# Altium schematic sheet sch.SchDoc
size A; SheetNumber: 1; SheetTotal: 1
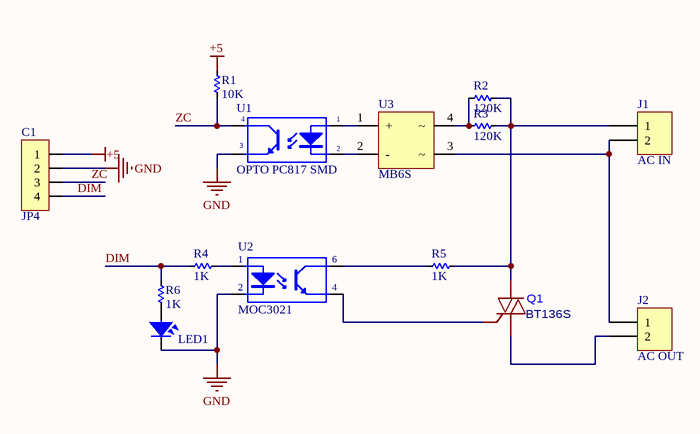
[diagram p0: sch.SchDoc]

## Parts
C1  JP4  [JP4-D1C]
J1  AC IN  [CON 2 2EDG5.08]
J2  AC OUT  [CON 2 2EDG5.08]
LED1  LED  [LED-0805-Red]  (value not drawn)
Q1  BT136S  [TO-252-3_L6.6-W6.1-P4.57-LS9.9-BR-CW]
R1  10K  [RES-SMD-0805]
R2  120K  [RES-SMD-1210]
R3  120K  [RES-SMD-1210]
R4  1K  [RES-SMD-0805]
R5  1K  [RES-SMD-0805]
R6  1K  [RES-SMD-0805]
U1  OPTO PC817 SMD  [SOP4]
U2  MOC3021  [SO6]
U3  MB6S  [TO269AA]

## Nets
+5: C1.1 R1.1
GND: C1.2 LED1.2 U1.3(E) U2.2(K)
DIM: C1.4 R4.2 R6.1
ZC: C1.3 R1.2 U1.4(C)
NetJ1_1: J1.1 Q1.2(T2) R2.1 R3.1 R5.1
NetJ1_2: J1.2 J2.1 U3.3
NetJ2_2: J2.2 Q1.1(T1)
NetLED1_1: LED1.1 R6.2
NetQ1_3: Q1.3(G) U2.4(E)
NetR2_2: R2.2 R3.2 U3.4
NetR4_1: R4.1 U2.1(A)
NetR5_2: R5.2 U2.6(C)
NetU1_1: U1.1(A) U3.1(+)
NetU1_2: U1.2(K) U3.2(-)

## Library data of the parts
C1 = JP4: WR-PHD 2.54 mm Angled Socket Header; Manufacturer: W¨¹rth Elektronik eiSos GmbH; partNo: 613004143121; ComponentLink1 Description: Manufacturer; ComponentLink2 Description: Datasheet; NoPins: 04; Created Date: 29 March 2013; ComponentLink1URL: http://www.we-online.com; ComponentLink2URL: http://katalog.we-online.de/em/datasheet/6130xx143121.pdf; Created by: Karrer Zheng
J1 J2 = CON 2: CON2 KF terminal
LED1 = LED SMD: Value: LED 3 - 5 ly 2 Colour
Q1 = BT136-800E_C2901010
R1-R6 = Res-SMD: Resistor; Manufacturer: Generic Components; Class: Passive; Published: 08/06/2000; Publisher: Altium Hobart Technology Centre
U1 = OPTO PC817 SMD: Single Opto; Value: PC817
U2 = MOC3021: Single Opto; Value: MOC3021
U3 = MB6S: Bridge Rectifier